# Altium schematic sheet Cross-Analog.SchDoc
size A1; Organization: Protel International P/L; Address1: L3, 12a Rodborough Rd; Address2: Frenchs Forest; Address3: NSW; Address4: Australia 2086
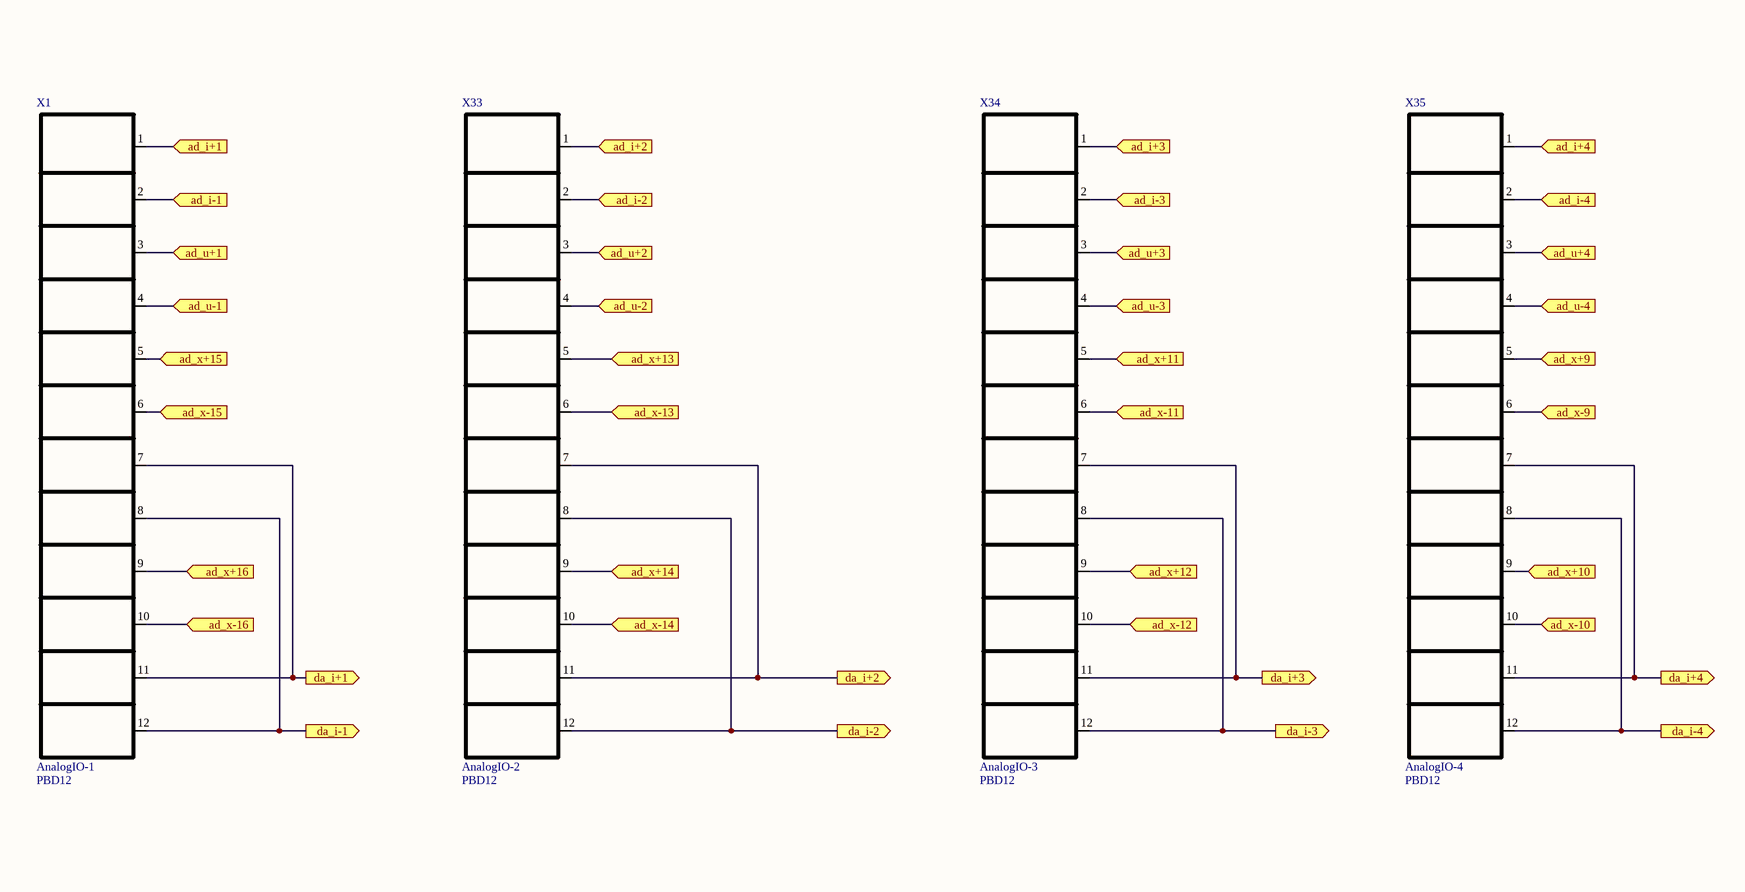
[diagram p0: Cross-Analog.SchDoc, left]
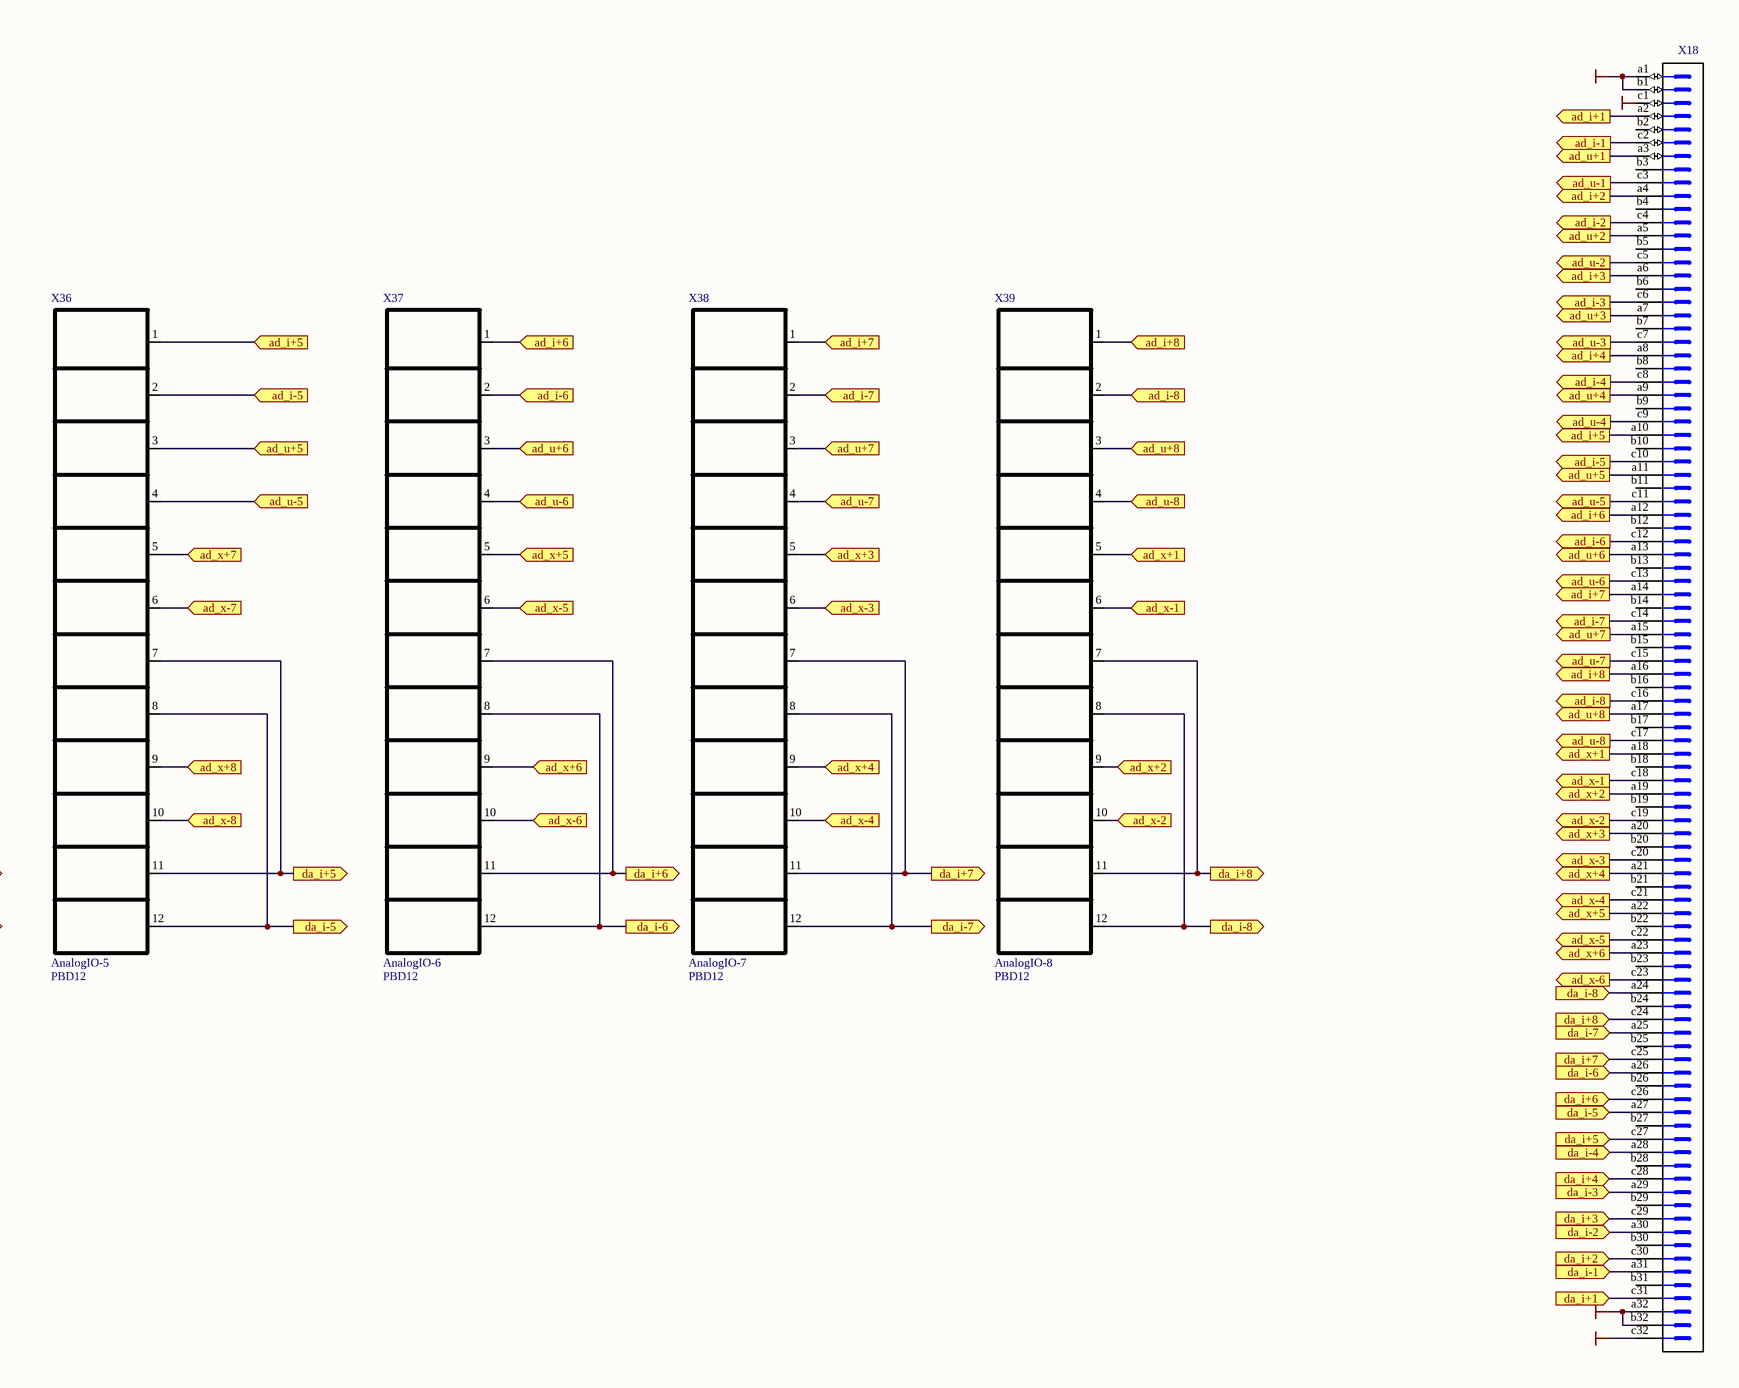
[diagram p1: Cross-Analog.SchDoc, right]

## Parts
X1  AnalogIO-1  [DIP_12-254_F]
X18  HARTING_09 03 196 6921  [HARTING_09 03 196 6921]  (value not drawn)
X33  AnalogIO-2  [DIP_12-254_F]
X34  AnalogIO-3  [DIP_12-254_F]
X35  AnalogIO-4  [DIP_12-254_F]
X36  AnalogIO-5  [DIP_12-254_F]
X37  AnalogIO-6  [DIP_12-254_F]
X38  AnalogIO-7  [DIP_12-254_F]
X39  AnalogIO-8  [DIP_12-254_F]

## Ports
ad_i+1 (in), ad_i+1 (out), ad_i+2 (in), ad_i+2 (out), ad_i+3 (in), ad_i+3 (out), ad_i+4 (in), ad_i+4 (out), ad_i+5 (in), ad_i+5 (out), ad_i+6 (in), ad_i+6 (out), ad_i+7 (in), ad_i+7 (out), ad_i+8 (in), ad_i+8 (out), ad_i-1 (in), ad_i-1 (out), ad_i-2 (in), ad_i-2 (out), ad_i-3 (in), ad_i-3 (out), ad_i-4 (in), ad_i-4 (out), ad_i-5 (in), ad_i-5 (out), ad_i-6 (in), ad_i-6 (out), ad_i-7 (in), ad_i-7 (out), ad_i-8 (in), ad_i-8 (out), ad_u+1 (in), ad_u+1 (out), ad_u+2 (in), ad_u+2 (out), ad_u+3 (in), ad_u+3 (out), ad_u+4 (in), ad_u+4 (out), ad_u+5 (in), ad_u+5 (out), ad_u+6 (in), ad_u+6 (out), ad_u+7 (in), ad_u+7 (out), ad_u+8 (in), ad_u+8 (out), ad_u-1 (in), ad_u-1 (out), ad_u-2 (in), ad_u-2 (out), ad_u-3 (in), ad_u-3 (out), ad_u-4 (in), ad_u-4 (out), ad_u-5 (in), ad_u-5 (out), ad_u-6 (in), ad_u-6 (out), ad_u-7 (in), ad_u-7 (out), ad_u-8 (in), ad_u-8 (out), ad_x+1 (in), ad_x+1 (out), ad_x+2 (in), ad_x+2 (out), ad_x+3 (in), ad_x+3 (out), ad_x+4 (in), ad_x+4 (out), ad_x+5 (in), ad_x+5 (out), ad_x+6 (in), ad_x+6 (out), ad_x+7 (in), ad_x+8 (in), ad_x+9 (in), ad_x+10 (in), ad_x+11 (in), ad_x+12 (in), ad_x+13 (in), ad_x+14 (in), ad_x+15 (in), ad_x+16 (in), ad_x-1 (in), ad_x-1 (out), ad_x-2 (in), ad_x-2 (out), ad_x-3 (in), ad_x-3 (out), ad_x-4 (in), ad_x-4 (out), ad_x-5 (in), ad_x-5 (out), ad_x-6 (in), ad_x-6 (out), ad_x-7 (in), ad_x-8 (in), ad_x-9 (in), ad_x-10 (in), ad_x-11 (in), ad_x-12 (in), ad_x-13 (in), ad_x-14 (in), ad_x-15 (in), ad_x-16 (in), da_i+1 (in), da_i+1 (out), da_i+2 (in), da_i+2 (out), da_i+3 (in), da_i+3 (out), da_i+4 (in), da_i+4 (out), da_i+5 (in), da_i+5 (out), da_i+6 (in), da_i+6 (out), da_i+7 (in), da_i+7 (out), da_i+8 (in), da_i+8 (out), da_i-1 (in), da_i-1 (out), da_i-2 (in), da_i-2 (out), da_i-3 (in), da_i-3 (out), da_i-4 (in), da_i-4 (out), da_i-5 (in), da_i-5 (out), da_i-6 (in), da_i-6 (out), da_i-7 (in), da_i-7 (out), da_i-8 (in), da_i-8 (out)

## Nets
GND: X18.a1 X18.a32 X18.b1 X18.b32 X18.c1 X18.c32
ad_i+1: X1.1 X18.a2 ; port ad_i+1
ad_i+2: X18.a4 X33.1 ; port ad_i+2
ad_i+3: X18.a6 X34.1 ; port ad_i+3
ad_i+4: X18.a8 X35.1 ; port ad_i+4
ad_i+5: X18.a10 X36.1 ; port ad_i+5
ad_i+6: X18.a12 X37.1 ; port ad_i+6
ad_i+7: X18.a14 X38.1 ; port ad_i+7
ad_i+8: X18.a16 X39.1 ; port ad_i+8
ad_i-1: X1.2 X18.c2 ; port ad_i-1
ad_i-2: X18.c4 X33.2 ; port ad_i-2
ad_i-3: X18.c6 X34.2 ; port ad_i-3
ad_i-4: X18.c8 X35.2 ; port ad_i-4
ad_i-5: X18.c10 X36.2 ; port ad_i-5
ad_i-6: X18.c12 X37.2 ; port ad_i-6
ad_i-7: X18.c14 X38.2 ; port ad_i-7
ad_i-8: X18.c16 X39.2 ; port ad_i-8
ad_u+1: X1.3 X18.a3 ; port ad_u+1
ad_u+2: X18.a5 X33.3 ; port ad_u+2
ad_u+3: X18.a7 X34.3 ; port ad_u+3
ad_u+4: X18.a9 X35.3 ; port ad_u+4
ad_u+5: X18.a11 X36.3 ; port ad_u+5
ad_u+6: X18.a13 X37.3 ; port ad_u+6
ad_u+7: X18.a15 X38.3 ; port ad_u+7
ad_u+8: X18.a17 X39.3 ; port ad_u+8
ad_u-1: X1.4 X18.c3 ; port ad_u-1
ad_u-2: X18.c5 X33.4 ; port ad_u-2
ad_u-3: X18.c7 X34.4 ; port ad_u-3
ad_u-4: X18.c9 X35.4 ; port ad_u-4
ad_u-5: X18.c11 X36.4 ; port ad_u-5
ad_u-6: X18.c13 X37.4 ; port ad_u-6
ad_u-7: X18.c15 X38.4 ; port ad_u-7
ad_u-8: X18.c17 X39.4 ; port ad_u-8
ad_x+1: X18.a18 X39.5 ; port ad_x+1
ad_x+2: X18.a19 X39.9 ; port ad_x+2
ad_x+3: X18.a20 X38.5 ; port ad_x+3
ad_x+4: X18.a21 X38.9 ; port ad_x+4
ad_x+5: X18.a22 X37.5 ; port ad_x+5
ad_x+6: X18.a23 X37.9 ; port ad_x+6
ad_x+7: X36.5 ; port ad_x+7
ad_x+8: X36.9 ; port ad_x+8
ad_x+9: X35.5 ; port ad_x+9
ad_x+10: X35.9 ; port ad_x+10
ad_x+11: X34.5 ; port ad_x+11
ad_x+12: X34.9 ; port ad_x+12
ad_x+13: X33.5 ; port ad_x+13
ad_x+14: X33.9 ; port ad_x+14
ad_x+15: X1.5 ; port ad_x+15
ad_x+16: X1.9 ; port ad_x+16
ad_x-1: X18.c18 X39.6 ; port ad_x-1
ad_x-2: X18.c19 X39.10 ; port ad_x-2
ad_x-3: X18.c20 X38.6 ; port ad_x-3
ad_x-4: X18.c21 X38.10 ; port ad_x-4
ad_x-5: X18.c22 X37.6 ; port ad_x-5
ad_x-6: X18.c23 X37.10 ; port ad_x-6
ad_x-7: X36.6 ; port ad_x-7
ad_x-8: X36.10 ; port ad_x-8
ad_x-9: X35.6 ; port ad_x-9
ad_x-10: X35.10 ; port ad_x-10
ad_x-11: X34.6 ; port ad_x-11
ad_x-12: X34.10 ; port ad_x-12
ad_x-13: X33.6 ; port ad_x-13
ad_x-14: X33.10 ; port ad_x-14
ad_x-15: X1.6 ; port ad_x-15
ad_x-16: X1.10 ; port ad_x-16
da_i+1: X1.7 X1.11 X18.c31 ; port da_i+1
da_i+2: X18.c30 X33.7 X33.11 ; port da_i+2
da_i+3: X18.c29 X34.7 X34.11 ; port da_i+3
da_i+4: X18.c28 X35.7 X35.11 ; port da_i+4
da_i+5: X18.c27 X36.7 X36.11 ; port da_i+5
da_i+6: X18.c26 X37.7 X37.11 ; port da_i+6
da_i+7: X18.c25 X38.7 X38.11 ; port da_i+7
da_i+8: X18.c24 X39.7 X39.11 ; port da_i+8
da_i-1: X1.8 X1.12 X18.a31 ; port da_i-1
da_i-2: X18.a30 X33.8 X33.12 ; port da_i-2
da_i-3: X18.a29 X34.8 X34.12 ; port da_i-3
da_i-4: X18.a28 X35.8 X35.12 ; port da_i-4
da_i-5: X18.a27 X36.8 X36.12 ; port da_i-5
da_i-6: X18.a26 X37.8 X37.12 ; port da_i-6
da_i-7: X18.a25 X38.8 X38.12 ; port da_i-7
da_i-8: X18.a24 X39.8 X39.12 ; port da_i-8

Not connected (* = marked no-connect by the designer): X18 b2(5) b3 b4 b5 b6 b7 b8 b9 b10 b11 b12 b13 b14 b15 b16 b17 b18 b19 b20 b21 b22 b23 b24 b25 b26 b27 b28 b29 b30 b31

## Notes on the sheet
- Title
- Size:
- Date:
- File:
- A1
- Number:
- Time:
- Revision:
- Sheet
- of

## Library data of the parts
X1 X33-X39 = PBD12: 12 pin TRH connector 2.54mm pitch; Vendor: Connfly; Pckage: DIP12- 2.54; Unit Price: 0.2; Device: PBD12
  X1: Value: AnalogIO-1
  X33: Value: AnalogIO-2
  X34: Value: AnalogIO-3
  X35: Value: AnalogIO-4
  X36: Value: AnalogIO-5
  X37: Value: AnalogIO-6
  X38: Value: AnalogIO-7
  X39: Value: AnalogIO-8
X18 = HARTING_09 03 196 6921: Connector 96 Male Right Angle; Vendor: HARTING; Unit Price: 6; Device: HARTING_09 03 196 6921